# Altium schematic sheet Sheet1.SchDoc
size A
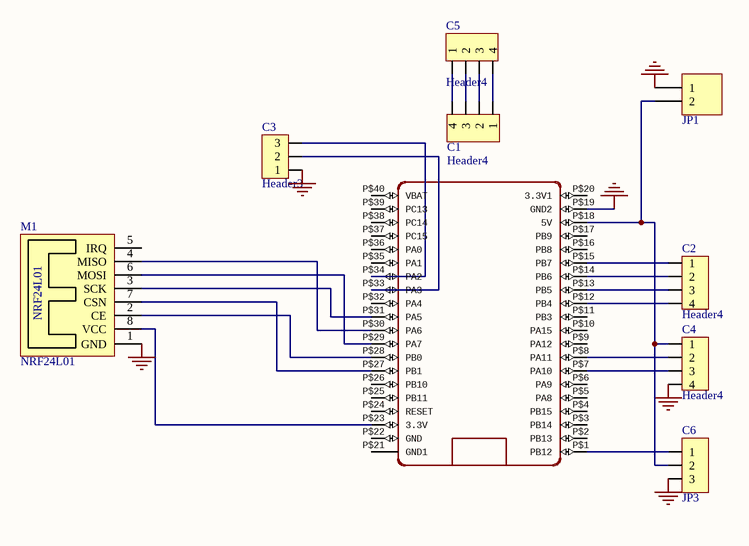
[diagram p0: Sheet1.SchDoc]

## Parts
C1  Header4  [Header4]
C2  Header4  [Header4]
C3  Header3  [Header3]
C4  Header4  [Header4]
C5  Header4  [Header4]
C6  JP3  [JP3-D1T]
JP1  Header 2_1  [HED2]  (value not drawn)
M1  NRF24L01  [NRF24L01]
U  BLUE_PILL  [BLUE_PILL]  (value not drawn)

## Nets
GND: C3.1 C4.4 C6.3 JP1.1 M1.1(GND) U.P$19(GND2)
NetC1_1: C1.1 C5.4
NetC1_2: C1.2 C5.3
NetC1_3: C1.3 C5.2
NetC1_4: C1.4 C5.1
NetC2_1: C2.1 U.P$15(PB7)
NetC2_2: C2.2 U.P$14(PB6)
NetC2_3: C2.3 U.P$13(PB5)
NetC2_4: C2.4 U.P$12(PB4)
NetC3_2: C3.2 U.P$33(PA3)
NetC3_3: C3.3 U.P$34(PA2)
NetC4_1: C4.1 C6.2 JP1.2 U.P$18(5V)
NetC4_2: C4.2 U.P$8(PA11)
NetC4_3: C4.3 U.P$7(PA10)
NetC6_1: C6.1 U.P$1(PB12)
NetM1_2: M1.2(CE) U.P$28(PB0)
NetM1_3: M1.3(SCK) U.P$31(PA5)
NetM1_4: M1.4(MISO) U.P$30(PA6)
NetM1_6: M1.6(MOSI) U.P$29(PA7)
NetM1_7: M1.7(CSN) U.P$27(PB1)
NetM1_8: M1.8(VCC) U.P$23(3.3V)

Not connected (* = marked no-connect by the designer): M1 5(IRQ); U P$2(PB13) P$3(PB14) P$4(PB15) P$5(PA8) P$6(PA9) P$9(PA12) P$10(PA15) P$11(PB3) P$16(PB8) P$17(PB9) P$20(3.3V1) P$21(GND1) P$22(GND) P$24(RESET) P$25(PB11) P$26(PB10) P$32(PA4) P$35(PA1) P$36(PA0) P$37(PC15) P$38(PC14) P$39(PC13) P$40(VBAT)

## Library data of the parts
C1 C2 C4 C5 = Header4: Header IDC, 4 x 1 Pin Vertical 2.54mm Pitch (Non-Boxed, Male); Manufacturer: W¨¹rth Elektronik eiSos GmbH; partNo: 613002143121; ComponentLink1 Description: Manufacturer; ComponentLink2 Description: Datasheet; NoPins: 02; Created Date: 29 March 2013; ComponentLink1URL: http://www.we-online.com; ComponentLink2URL: http://katalog.we-online.de/em/datasheet/6130xx143121.pdf; Created by: Karrer Zheng
C3 = Header3: Header IDC, 3 x 1 Pin Vertical 2.54mm Pitch (Non-Boxed, Male); Manufacturer: W¨¹rth Elektronik eiSos GmbH; partNo: 613002143121; ComponentLink1 Description: Manufacturer; ComponentLink2 Description: Datasheet; NoPins: 02; Created Date: 29 March 2013; ComponentLink1URL: http://www.we-online.com; ComponentLink2URL: http://katalog.we-online.de/em/datasheet/6130xx143121.pdf; Created by: Karrer Zheng
C6 = JP3: WR-PHD 2.54 mm Angled Socket Header; Manufacturer: W¨¹rth Elektronik eiSos GmbH; partNo: 613003143121; ComponentLink1 Description: Manufacturer; ComponentLink2 Description: Datasheet; NoPins: 03; Created Date: 29 March 2013; ComponentLink1URL: http://www.we-online.com; ComponentLink2URL: http://katalog.we-online.de/em/datasheet/6130xx143121.pdf; Created by: Karrer Zheng
JP1 = Header 2_1: Header, 2-Pin; Manufacturer: Generic Components; Class: Connector; Value: Header 2
U = BLUE_PILL: GateName_1: G$1; SymbolName_1: BLUE_PILL; LibraryName: BluePill; DeviceSetName: BLUE_PILL; Package: BLUE_PILL